# Altium schematic sheet MainBoard_V100_CHARGER.SchDoc
size A4; SheetNumber: 4; SheetTotal: 22; Title_: Battery Charger & Balancer
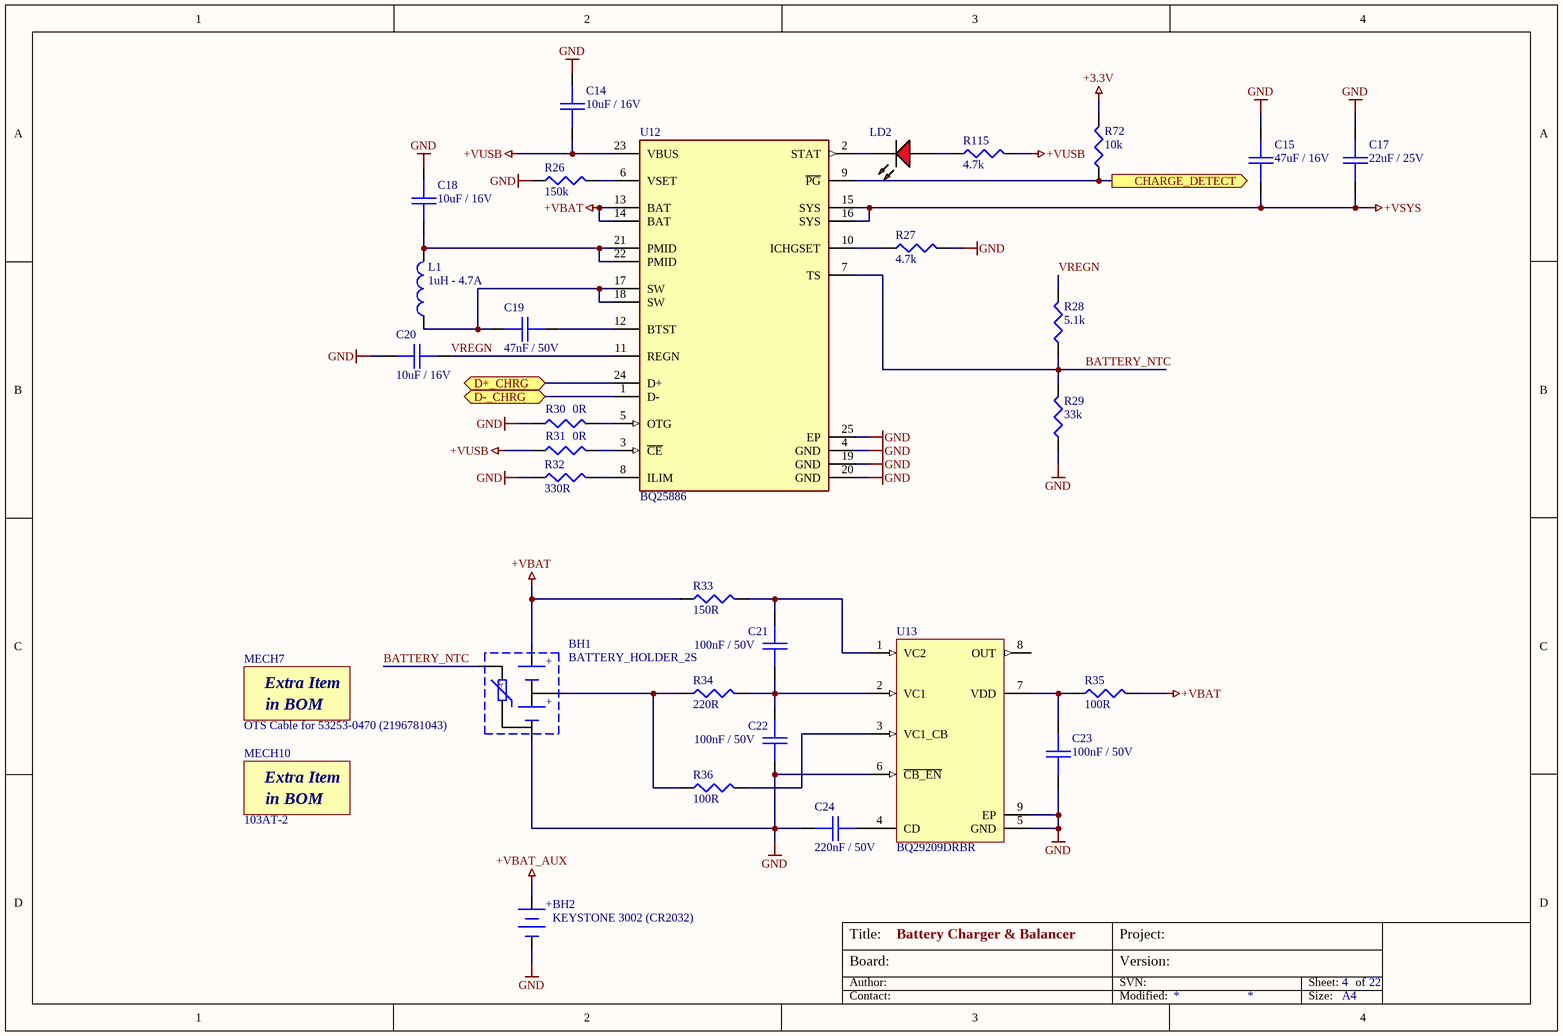
[diagram p0: MainBoard_V100_CHARGER.SchDoc]

## Parts
BH1  BATTERY_HOLDER_2S  [MOLEX-53253-0470]
BH2  KEYSTONE 3002 (CR2032)  [BATTERY_HOLDER_KEYSTONE_3002]
C14  10uF / 16V  [0805_C]
C15  47uF / 16V  [1210_C]
C17  22uF / 25V  [1210_C]
C18  10uF / 16V  [0805_C]
C19  47nF / 50V  [0805_C]
C20  10uF / 16V  [0805_C]
C21  100nF / 50V  [0805_C]
C22  100nF / 50V  [0805_C]
C23  100nF / 50V  [0805_C]
C24  220nF / 50V  [0805_C]
L1  1uH - 4.7A  [2520_IND]
LD2  HSMS-C110 (RED)  [LED_SMD_90DEG_RED]  (value not drawn)
MECH7  OTS Cable for 53253-0470 (2196781043)  (mechanical)
MECH10  103AT-2  (mechanical)
R26  150k  [0805]
R27  4.7k  [0805]
R28  5.1k  [0805]
R29  33k  [0805]
R30  0R  [0805]
R31  0R  [0805]
R32  330R  [0805]
R33  150R  [0805]
R34  220R  [0805]
R35  100R  [0805]
R36  100R  [0805]
R72  10k  [0805]
R115  4.7k  [0805]
U12  BQ25886  [VQFN-24]
U13  BQ29209DRBR  [VSON-8]

## Ports
CHARGE_DETECT (out), D+_CHRG (bidir), D-_CHRG (bidir)

## Nets
+3.3V: R72.2
+VBAT: BH1.1 R33.1 R35.1 U12.13(BAT) U12.14(BAT)
+VBAT_AUX: BH2.1
+VSYS: C15.2 C17.2 U12.15(SYS) U12.16(SYS)
+VUSB: C14.2 R31.1 R115.2 U12.23(VBUS)
GND: BH1.3 BH2.2 C14.1 C15.1 C17.1 C18.1 C20.1 C22.2 C23.1 C24.1 R26.1 R27.2 R29.1 R30.1 R32.1 U12.4(GND) U12.19(GND) U12.20(GND) U12.25(EP) U13.5(GND) U13.6(~{CB_EN}) U13.9(EP)
BATTERY_NTC: BH1.4 R28.1 R29.2 U12.7(TS)
CHARGE_DETECT: R72.1 U12.9(~{PG}) ; port CHARGE_DETECT
D+_CHRG: U12.24(D+) ; port D+_CHRG
D-_CHRG: U12.1(D-) ; port D-_CHRG
VREGN: C20.2 R28.2 U12.11(REGN)
NetBH1_2: BH1.2 R34.1 R36.1
NetC18_2: C18.2 L1.2 U12.21(PMID) U12.22(PMID)
NetC19_1: C19.1 L1.1 U12.17(SW) U12.18(SW)
NetC19_2: C19.2 U12.12(BTST)
NetC21_1: C21.1 R33.2 U13.1(VC2)
NetC21_2: C21.2 C22.1 R34.2 U13.2(VC1)
NetC23_2: C23.2 R35.2 U13.7(VDD)
NetC24_2: C24.2 U13.4(CD)
NetLD2_A: LD2.A R115.1
NetLD2_K: LD2.K U12.2(STAT)
NetR26_2: R26.2 U12.6(VSET)
NetR27_1: R27.1 U12.10(ICHGSET)
NetR30_2: R30.2 U12.5(OTG)
NetR31_2: R31.2 U12.3(~{CE})
NetR32_2: R32.2 U12.8(ILIM)
NetR36_2: R36.2 U13.3(VC1_CB)

Not connected (* = marked no-connect by the designer): U13 8(OUT)

## Notes on the sheet
- Board:
- Author:
- Title:
- Project:
- SVN:
- Version:
- Sheet:
- of
- Contact:
- Modified:
- Size:
- A4
- (in symbol 252) +
- (in symbol 380) +; -t°
- (in symbol 409) Extra Item; in BOM
- (in symbol 410) Extra Item; in BOM

## Library data of the parts
BH1 = 380: 2S Battery with NTC thermistor; Azonosító: 380; Part Number: BATTERY_HOLDER_2S; Category: Accessories; Subcategory: ACCE_Battery
BH2 = 252: Battery Holder, CR2032; Part Number: BATTERY_HOLDER_CR2032; Azonosító: 252; Category: Connectors; Subcategory: CONN_Other; Supplier 1: MOUSER; Supplier 1 order number: 534-3002; Supplier 2: FARNELL; Supplier 2 order number: 1650693; Help URL: https://hu.mouser.com/datasheet/2/215/3002TR-745631.pdf
C14 C18 C20 = 153: 10uF 16V X5R; Part Number: SMD0805-10uF-16V; Azonosító: 153; Category: Passives; Subcategory: PASS_Capacitor; Supplier 1: HESTORE; Supplier 1 order number: 100.344.52
C15 = 171: 47uF 16V X5R; Part Number: SMD1210-47uF-16V; Azonosító: 171; Category: Passives; Subcategory: PASS_Capacitor; Supplier 1: HESTORE; Supplier 1 order number: 100.353.29
C17 = 170: 22uF 25V X5R; Part Number: SMD1210-22uF-25V; Azonosító: 170; Category: Passives; Subcategory: PASS_Capacitor; Supplier 1: HESTORE; Supplier 1 order number: 100.353.27
C19 = 375: 47nF 50V X7R; Part Number: SMD0805-47nF-50V; Azonosító: 375; Category: Passives; Subcategory: PASS_Capacitor; Supplier 1: HESTORE; Supplier 1 order number: 100.011.36
C21-C23 = 149: 100nF 50V X7R; Part Number: SMD0805-100nF-50V; Azonosító: 149; Category: Passives; Subcategory: PASS_Capacitor; Supplier 1: HESTORE; Supplier 1 order number: 100.011.22
C24 = 150: 220nF 50V Y5V; Part Number: SMD0805-220nF-50V; Azonosító: 150; Category: Passives; Subcategory: PASS_Capacitor; Supplier 1: HESTORE; Supplier 1 order number: 100.200.75
L1 = 376: 1uH  / 20% 4.7A; Part Number: SMD-2520-1uH-20%; Azonosító: 376; Category: Passives; Subcategory: PASS_Inductor; Supplier 1: MOUSER; Supplier 1 order number: 81-DFE252012F-1R0MP2; Help URL: https://hu.mouser.com/datasheet/2/281/1/J_E_TE243A_0017-3158849.pdf
LD2 = 290: LED, Red, SMD, 20 mA, 2.1 V, 626 nm; Azonosító: 290; Part Number: HSMS-C110; Category: Optoelectronics; Subcategory: OPTO_LED; Supplier 1: MOUSER; Supplier 1 order number: 630-HSMS-C110; Supplier 2: FARNELL; Supplier 2 order number: 3229567; Help URL: https://hu.mouser.com/datasheet/2/678/AV02_0551EN_DS_HSMx_Cxxx_25Mar2022-1827675.pdf
MECH7 = 409: Rectangular Cable Assemblies Micro-Latch-to-Micro-Latch (OTS) Cbl Asmbly 2mm Pitch Tin Plating 300mm Length 4; Azonosító: 409; Part Number: 2196781043; Category: Accessories; Subcategory: ACCE_Other; Supplier 1: MOUSER; Supplier 1 order number: 538-219678-1043; Help URL: https://www.molex.com/en-us/products/part-detail/2196781043
MECH10 = 410: NTC (Negative Temperature Coefficient) Thermistors 10kohm 1%; Azonosító: 410; Part Number: 103AT-2; Category: Accessories; Subcategory: ACCE_Other; Supplier 1: MOUSER; Supplier 1 order number: 954-103AT-2; Help URL: https://hu.mouser.com/datasheet/2/362/semitec_atthermistor-1202913.pdf
R26 = 377: 150k 0805 0.125W 1%; Part Number: SMD-0805-150k-1%; Azonosító: 377; Category: Passives; Subcategory: PASS_Resistor; Supplier 1: HESTORE; Supplier 1 order number: 100.397.63
R27 R115 = 56: 4.7k 0805 0.125W 5%; Part Number: SMD0805-4.7k 5%; Azonosító: 56; Category: Passives; Subcategory: PASS_Resistor; Supplier 1: HESTORE; Supplier 1 order number: 100.011.83
R28 = 378: 5.1k 0805 0.125W 5%; Part Number: SMD0805-5.1k 5%; Azonosító: 378; Category: Passives; Subcategory: PASS_Resistor; Supplier 1: HESTORE; Supplier 1 order number: 100.013.49
R29 = 62: 33k 0805 0.125W 5%; Part Number: SMD0805-33k 5%; Azonosító: 62; Category: Passives; Subcategory: PASS_Resistor; Supplier 1: HESTORE; Supplier 1 order number: 100.449.27
R30 R31 = 38: 0R 0805 0.125W 5%; Part Number: 0 R 5%; Azonosító: 38; Category: Passives; Subcategory: PASS_Resistor; Supplier 1: HESTORE; Supplier 1 order number: 100.275.70
R32 = 48: 330R 0805 0.125W 5%; Part Number: SMD0805-330R 5%; Azonosító: 48; Category: Passives; Subcategory: PASS_Resistor; Supplier 1: HESTORE; Supplier 1 order number: 100.011.70
R33 = 46: 150R 0805 0.125W 5%; Part Number: SMD0805-150R 5%; Azonosító: 46; Category: Passives; Subcategory: PASS_Resistor; Supplier 1: HESTORE; Supplier 1 order number: 100.011.49
R34 = 47: 220R 0805 0.125W 5%; Part Number: SMD0805-220R 5%; Azonosító: 47; Category: Passives; Subcategory: PASS_Resistor; Supplier 1: HESTORE; Supplier 1 order number: 100.011.62
R35 R36 = 45: 100R 0805 0.125W 5%; Part Number: SMD0805-100R 5%; Azonosító: 45; Category: Passives; Subcategory: PASS_Resistor; Supplier 1: HESTORE; Supplier 1 order number: 100.449.24
R72 = 59: 10k 0805 0.125W 1%; Part Number: SMD0805-10k 1%; Azonosító: 59; Category: Passives; Subcategory: PASS_Resistor; Supplier 1: HESTORE; Supplier 1 order number: 100.403.38
U12 = 368: Battery Management Standalone 2 cell 2A Boost battery charger for USB input with Power Path 24-VQFN -40 to 85; Azonosító: 368; Part Number: BQ25886; Category: Semiconductors; Subcategory: IC_Power; Supplier 1: MOUSER; Supplier 1 order number: 595-BQ25886RGER; Supplier 2: DIGIKEY; Supplier 2 order number: 296-53573-1-ND
U13 = 367: Voltage Protection with Automatic Cell Balance for 2-Cell Li-Ion Batteries, OVP=4.3 V, -40 to 85 degC, 8-pin SON (DRB), Green (RoHS & no Sb/Br); Manufacturer: Texas Instruments; SubFamily: Lithium Ion Protection; Lead Acid: N; Azonosító: 367; PackageReference: DRB0008B; Li-Ion: N; PackageVersion: revK, Jun-2012; PartNumber: BQ29209DRBR; Eco-Plan: Green (RoHS & no Sb/Br); DatasheetVersion: SLUSA52A; PackageDescription: 8-Pin Plastic Small Outline No-Lead, 3 x 3 x 1 mm Body, 0.65 mm Pitch, Exposed Pad; Li-Polymer: N; Mounting Technology: Surface Mount; Over Voltage Protection: N; NiCd: N; ComponentLink1URL: http://www.ti.com/general/docs/lit/getliterature.tsp?genericPartNumber=BQ29209&fileType=pdf; ComponentLink1Description: Datasheet; NiMH: N; Part Number: BQ29209DRBR; Category: Semiconductors; Subcategory: IC_Power; Supplier 1: MOUSER; Supplier 1 order number: 595-BQ29209DRBR; Help URL: https://www.ti.com/lit/ds/symlink/bq29209.pdf?ts=1707500814876&ref_url=https%253A%252F%252Fwww.ti.com%252Fproduct%252Fde-de%252FBQ29209